# Altium schematic sheet CON_PCI Express Mini_P1_52PIN.SchDoc: PCI Express Mini 52Pin
size A4
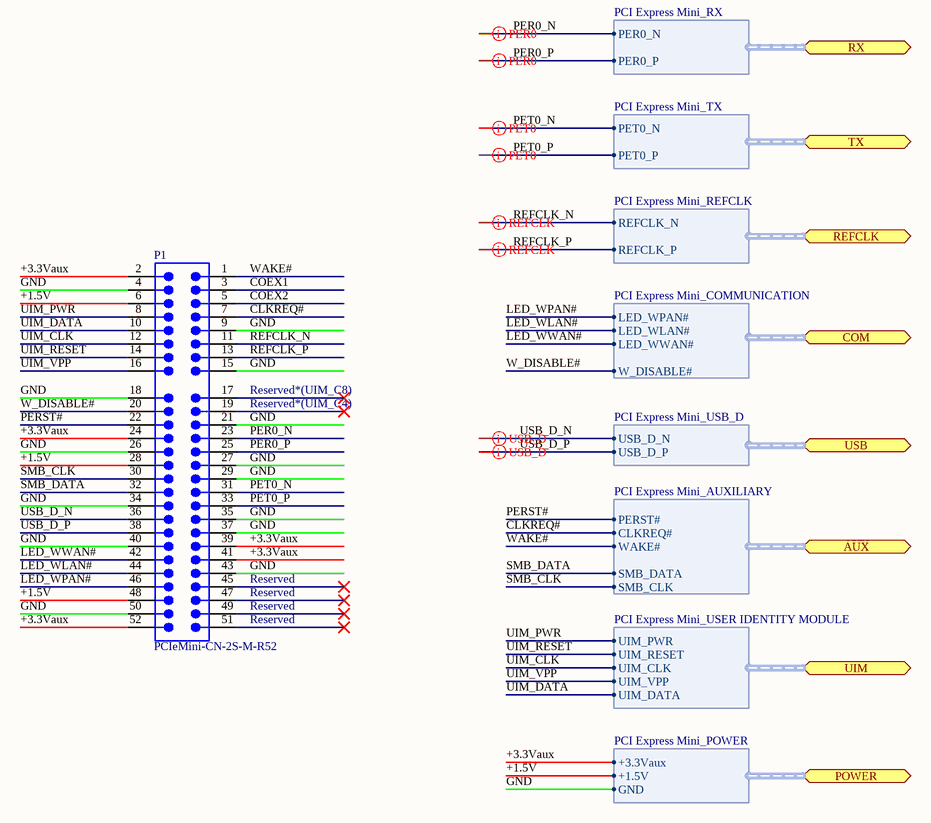
[diagram p0: CON_PCI Express Mini_P1_52PIN.SchDoc]

## Parts
P1  PCIeMini-CN-2S-M-R52  [PCIeMini-GF-2D-800-1K-S52]  (no BOM)

## Ports
AUX (harness PCI Express Mini_AUXILIARY), COM (harness PCI Express Mini_COMMUNICATION), POWER (harness PCI Express Mini_POWER), REFCLK (harness PCI Express Mini_REFCLK), RX (harness PCI Express Mini_RX), TX (harness PCI Express Mini_TX), UIM (harness PCI Express Mini_USER IDENTITY MODULE), USB (harness PCI Express Mini_USB_D)

## Harnesses
PCI Express Mini_REFCLK: REFCLK_N, REFCLK_P
PCI Express Mini_RX: PER0_N, PER0_P
PCI Express Mini_TX: PET0_N, PET0_P
PCI Express Mini_USB_D: USB_D_N, USB_D_P
PCI Express Mini_POWER: +3.3Vaux, +1.5V, GND
PCI Express Mini_AUXILIARY: PERST#, CLKREQ#, WAKE#, SMB_DATA, SMB_CLK
PCI Express Mini_COMMUNICATION: LED_WPAN#, LED_WLAN#, LED_WWAN#, W_DISABLE#
PCI Express Mini_USER IDENTITY MODULE: UIM_PWR, UIM_RESET, UIM_CLK, UIM_VPP, UIM_DATA

## Nets
+1.5V: P1.6 P1.28 P1.48 ; port POWER.+1.5V
+3.3Vaux: P1.2 P1.24 P1.39 P1.41 P1.52 ; port POWER.+3.3Vaux
CLKREQ#: P1.7 ; port AUX.CLKREQ#
COEX1: P1.3
COEX2: P1.5
GND: P1.4 P1.9 P1.15 P1.18 P1.21 P1.26 P1.27 P1.29 P1.34 P1.35 P1.37 P1.40 P1.43 P1.50 ; port POWER.GND
LED_WLAN#: P1.44 ; port COM.LED_WLAN#
LED_WPAN#: P1.46 ; port COM.LED_WPAN#
LED_WWAN#: P1.42 ; port COM.LED_WWAN#
PER0_N: P1.23 ; port RX.PER0_N
PER0_P: P1.25 ; port RX.PER0_P
PERST#: P1.22 ; port AUX.PERST#
PET0_N: P1.31 ; port TX.PET0_N
PET0_P: P1.33 ; port TX.PET0_P
REFCLK_N: P1.11 ; port REFCLK.REFCLK_N
REFCLK_P: P1.13 ; port REFCLK.REFCLK_P
SMB_CLK: P1.30 ; port AUX.SMB_CLK
SMB_DATA: P1.32 ; port AUX.SMB_DATA
UIM_CLK: P1.12 ; port UIM.UIM_CLK
UIM_DATA: P1.10 ; port UIM.UIM_DATA
UIM_PWR: P1.8 ; port UIM.UIM_PWR
UIM_RESET: P1.14 ; port UIM.UIM_RESET
UIM_VPP: P1.16 ; port UIM.UIM_VPP
USB_D_N: P1.36 ; port USB.USB_D_N
USB_D_P: P1.38 ; port USB.USB_D_P
W_DISABLE#: P1.20 ; port COM.W_DISABLE#
WAKE#: P1.1 ; port AUX.WAKE#

Not connected (* = marked no-connect by the designer): P1 17* 19* 45* 47* 49* 51*

## Layout directives
differential pair: PER0_N, PER0_P, PET0_N, PET0_P, REFCLK_N, REFCLK_P, USB_D_N, USB_D_P

## Notes on the sheet
- (near P1) Reserved*(UIM_C8)
- (near P1) Reserved*(UIM_C4)
- (near P1) Reserved
- Sheet Title
- Project Title
- Size:
- Date:
- A4
- Item:
- Time:
- Revision:
- Sheet
- of
- File:

## Library data of the parts
P1 = CMP-0001-00067-2: Golden finger, PCIeMini, Dual, Staggered, Pitch 0.8mm, 52-Position; Mating Connector: Tyco-292443-1; Package Version: rev1.2, Oct-2007; Publisher: Altium; Package Reference: PCIeMini-GF-2D-800-1K-S52; ClassName: Edge Connector; Datasheet Version: Revision 1.2 Oct-2007